# EAGLE design idp (EAGLE 9.6.2)
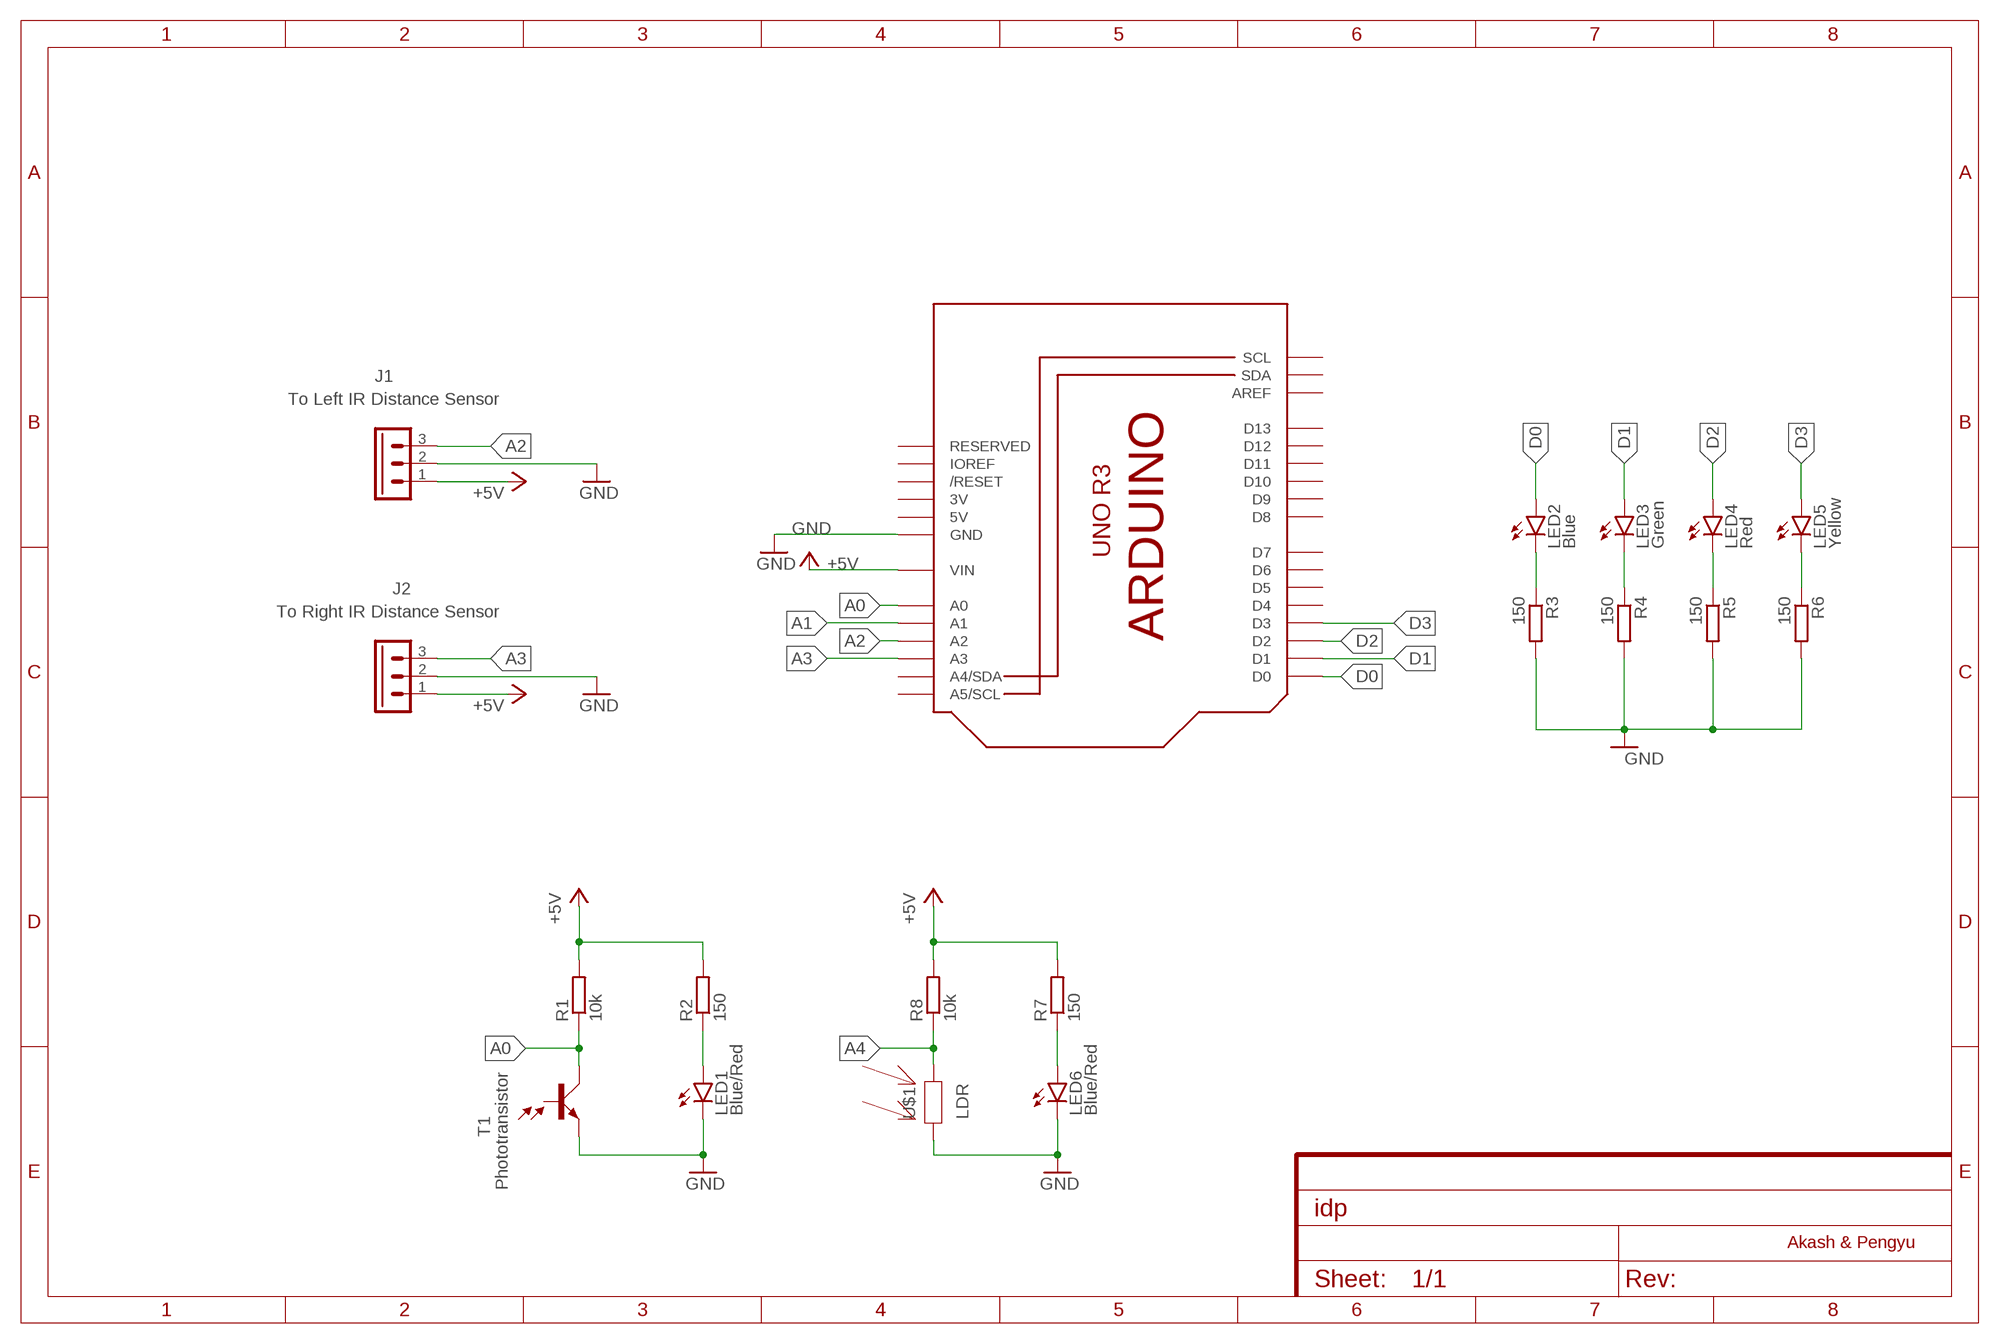
[diagram p0: schematic, sheet 1]

## Parts
J1  To Left IR Distance Sensor  22-05-7038-03  [7395-03]
J2  To Right IR Distance Sensor  22-05-7038-03  [7395-03]
LED1  Blue/Red  LED_23MM  [LED3MM]
LED2  Blue  LED_23MM  [LED3MM]
LED3  Green  LED_23MM  [LED3MM]
LED4  Red  LED_23MM  [LED3MM]
LED5  Yellow  LED_23MM  [LED3MM]
LED6  Blue/Red  LED_23MM  [LED3MM]
M1  IDP_PROTOBOARD  [IDP_PROTO]
R1  10k  R-EU_0204/7  [0204/7]
R2  150  R-EU_0204/7  [0204/7]
R3  150  R-EU_0204/2V  [0204V]
R4  150  R-EU_0204/2V  [0204V]
R5  150  R-EU_0204/2V  [0204V]
R6  150  R-EU_0204/2V  [0204V]
R7  150  R-EU_0204/7  [0204/7]
R8  10k  R-EU_0204/7  [0204/7]
T1  Phototransistor  SFH303  [SFH303]
U$1  LDR  [LDR]

## Nets
+5V: J1.1 J2.1 M1.VIN R1.2 R2.2 R7.2 R8.2
A0: M1.A0 R1.1 T1.2(C)
A1: M1.A1
A2: J1.3 M1.A2
A3: J2.3 M1.A3
A4: R8.1 U$1.P$2
D0: LED2.A M1.D0
D1: LED3.A M1.D1
D2: LED4.A M1.D2
D3: LED5.A M1.D3
GND: J1.2 J2.2 LED1.K(C) LED6.K(C) M1.GND M1.GND16(GND) M1.GND17(GND) M1.GND18(GND) M1.GND19(GND) M1.GND20(GND) M1.GND21(GND) M1.GND22(GND) M1.GND23(GND) M1.GND24(GND) M1.GND25(GND) M1.GND@1(GND) M1.GND@2(GND) M1.GND@3(GND) M1.GND@4(GND) M1.GND@5(GND) M1.GND@6(GND) M1.GND@7(GND) M1.GND@8(GND) M1.GND@9(GND) M1.GND@10(GND) M1.GND@11(GND) M1.GND@12(GND) M1.GND@13(GND) M1.GND@14(GND) M1.GND@15(GND) M1.GND@26(GND) M1.GND@27(GND) M1.GND@28(GND) M1.GND@29(GND) M1.GND@30(GND) M1.GND@31(GND) M1.GND@32(GND) M1.GND@33(GND) M1.GND@34(GND) M1.GND@35(GND) M1.GND@36(GND) M1.GND@37(GND) M1.GND@38(GND) M1.GND@39(GND) M1.GND@40(GND) M1.GND@41(GND) M1.GND@42(GND) M1.GND@43(GND) M1.GND@44(GND) M1.GND@45(GND) M1.GND@46(GND) M1.GND@47(GND) M1.GND@48(GND) R3.2 R4.2 R5.2 R6.2 T1.1(E) U$1.P$1
N$1: LED2.K(C) R3.1
N$2: LED6.A R7.1
N$3: LED1.A R2.1
N$4: LED3.K(C) R4.1
N$5: LED4.K(C) R5.1
N$12: LED5.K(C) R6.1
Unconnected: M1.A4(A4/SDA) M1.A5(A5/SCL) M1.AREF M1.D4 M1.D5 M1.D6 M1.D7 M1.D8 M1.D9 M1.D10 M1.D11 M1.D12 M1.D13 M1.IOREF M1.RESERVED M1.RESET(/RESET) M1.SCL M1.SDA T1.3(B)

## Notes on the sheet
- Akash & Pengyu

## Power pins joined to a net without a drawn wire
3V: M1.3V
5V: M1.5V M1.5V@0(5V) M1.5V@1(5V) M1.5V@2(5V) M1.5V@3(5V) M1.5V@4(5V) M1.5V@5(5V) M1.5V@6(5V) M1.5V@7(5V) M1.5V@8(5V) M1.5V@9(5V) M1.5V@10(5V) M1.5V@11(5V) M1.5V@12(5V) M1.5V@13(5V) M1.5V@14(5V) M1.5V@15(5V) M1.5V@16(5V) M1.5V@17(5V) M1.5V@18(5V) M1.5V@19(5V) M1.5V@20(5V) M1.5V@21(5V) M1.5V@22(5V) M1.5V@23(5V) M1.5V@24(5V) M1.5V@25(5V) M1.5V@26(5V) M1.5V@27(5V) M1.5V@28(5V) M1.5V@29(5V) M1.5V@30(5V) M1.5V@31(5V) M1.5V@32(5V) M1.5V@33(5V) M1.5V@34(5V) M1.5V@35(5V) M1.5V@36(5V) M1.5V@37(5V) M1.5V@38(5V) M1.5V@39(5V) M1.5V@40(5V)

## Library data of the parts
J1 J2 = IDP_library:22-?-03: CONNECTOR wire to board 2.54 mm (.1 inch) pitch header 3 pin Right angle and straight; MF: MOLEX; OC_FARNELL: unknown; OC_NEWARK: unknown
LED1-LED6 = IDP_library:LED_2: LED
M1 = IDP_library:IDP_PROTOBOARD
R1-R8 = IDP_library:R-EU_: RESISTOR, European symbol; SPICEPREFIX: R
T1 = opto-trans-siemens:SFH303: Silicium NPN Phototransistor Source: Siemens; OC_FARNELL: unknown; OC_NEWARK: unknown
U$1 = IDP_library:LDR

## Board
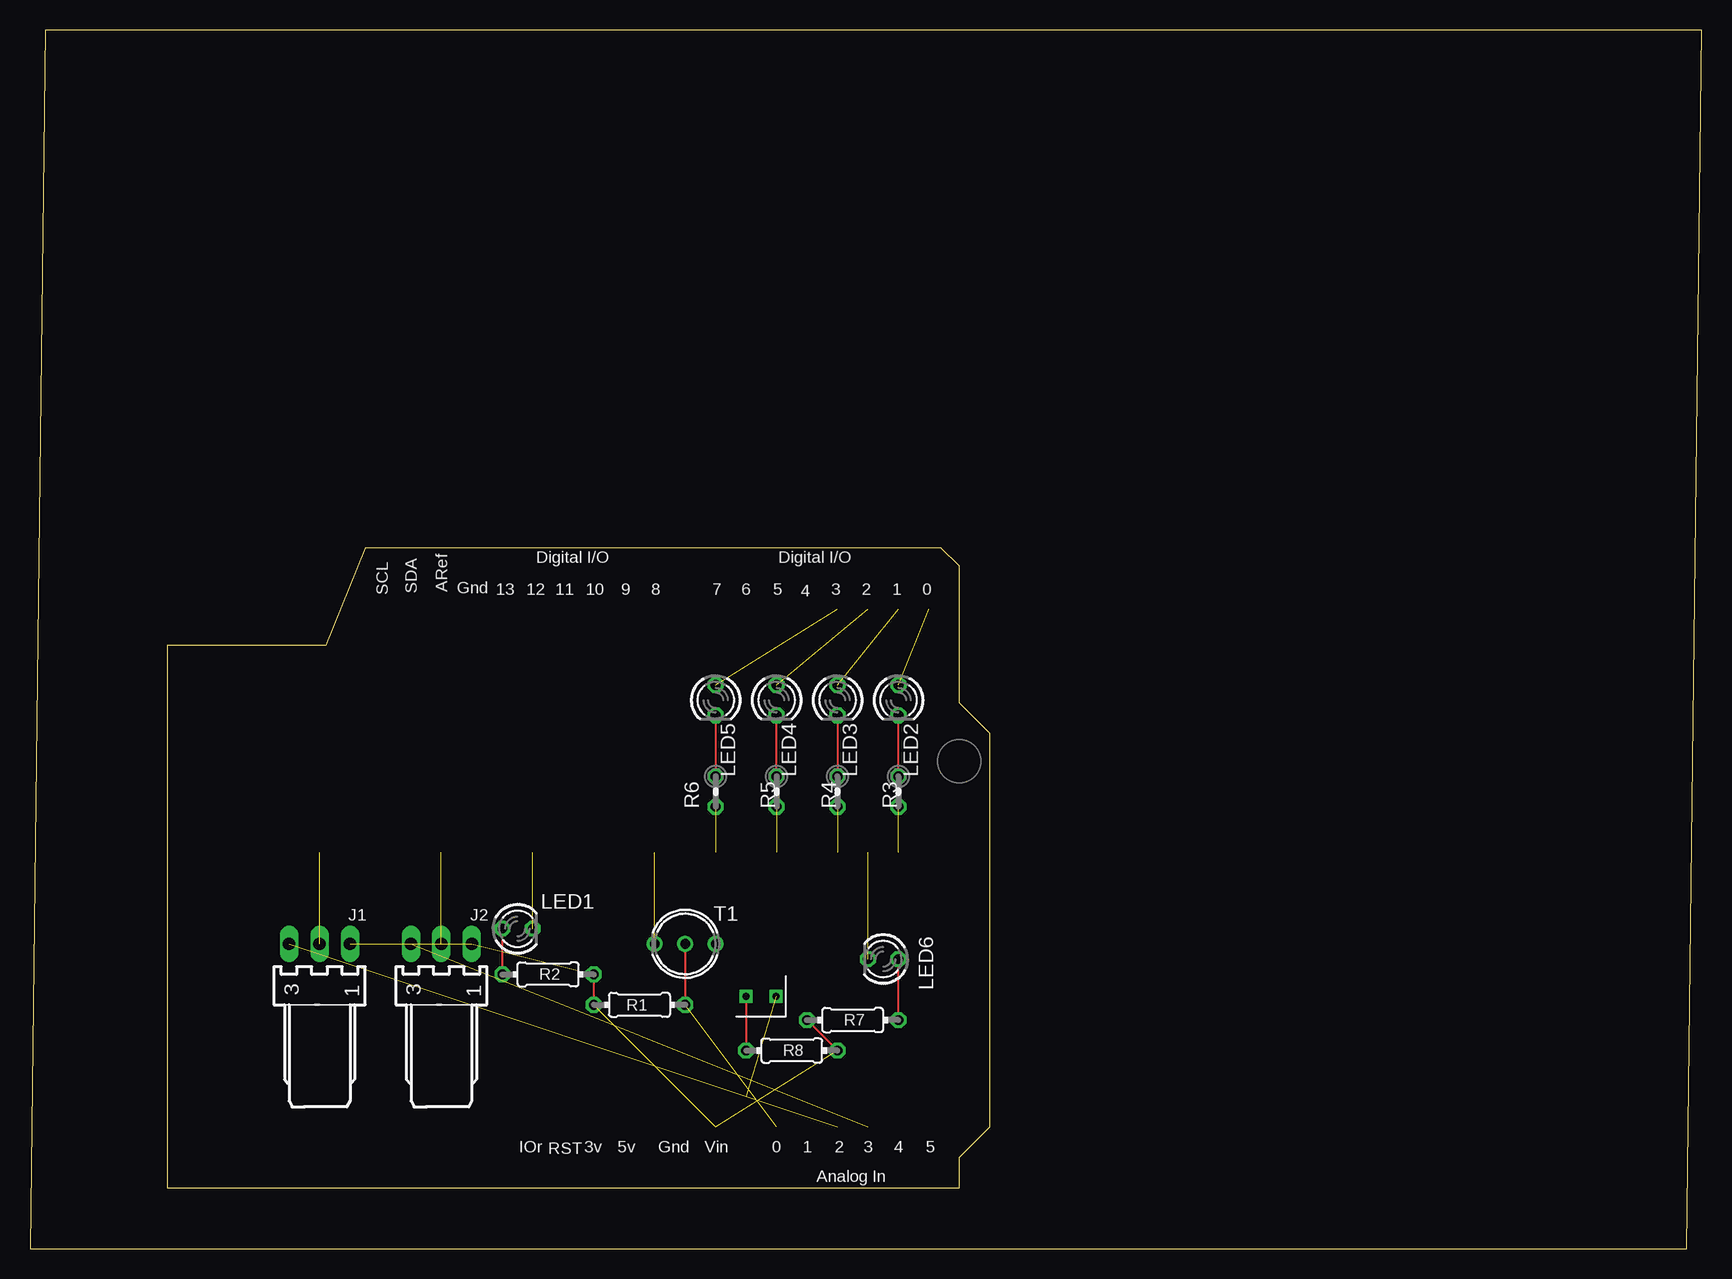
[diagram p1: board, top side]
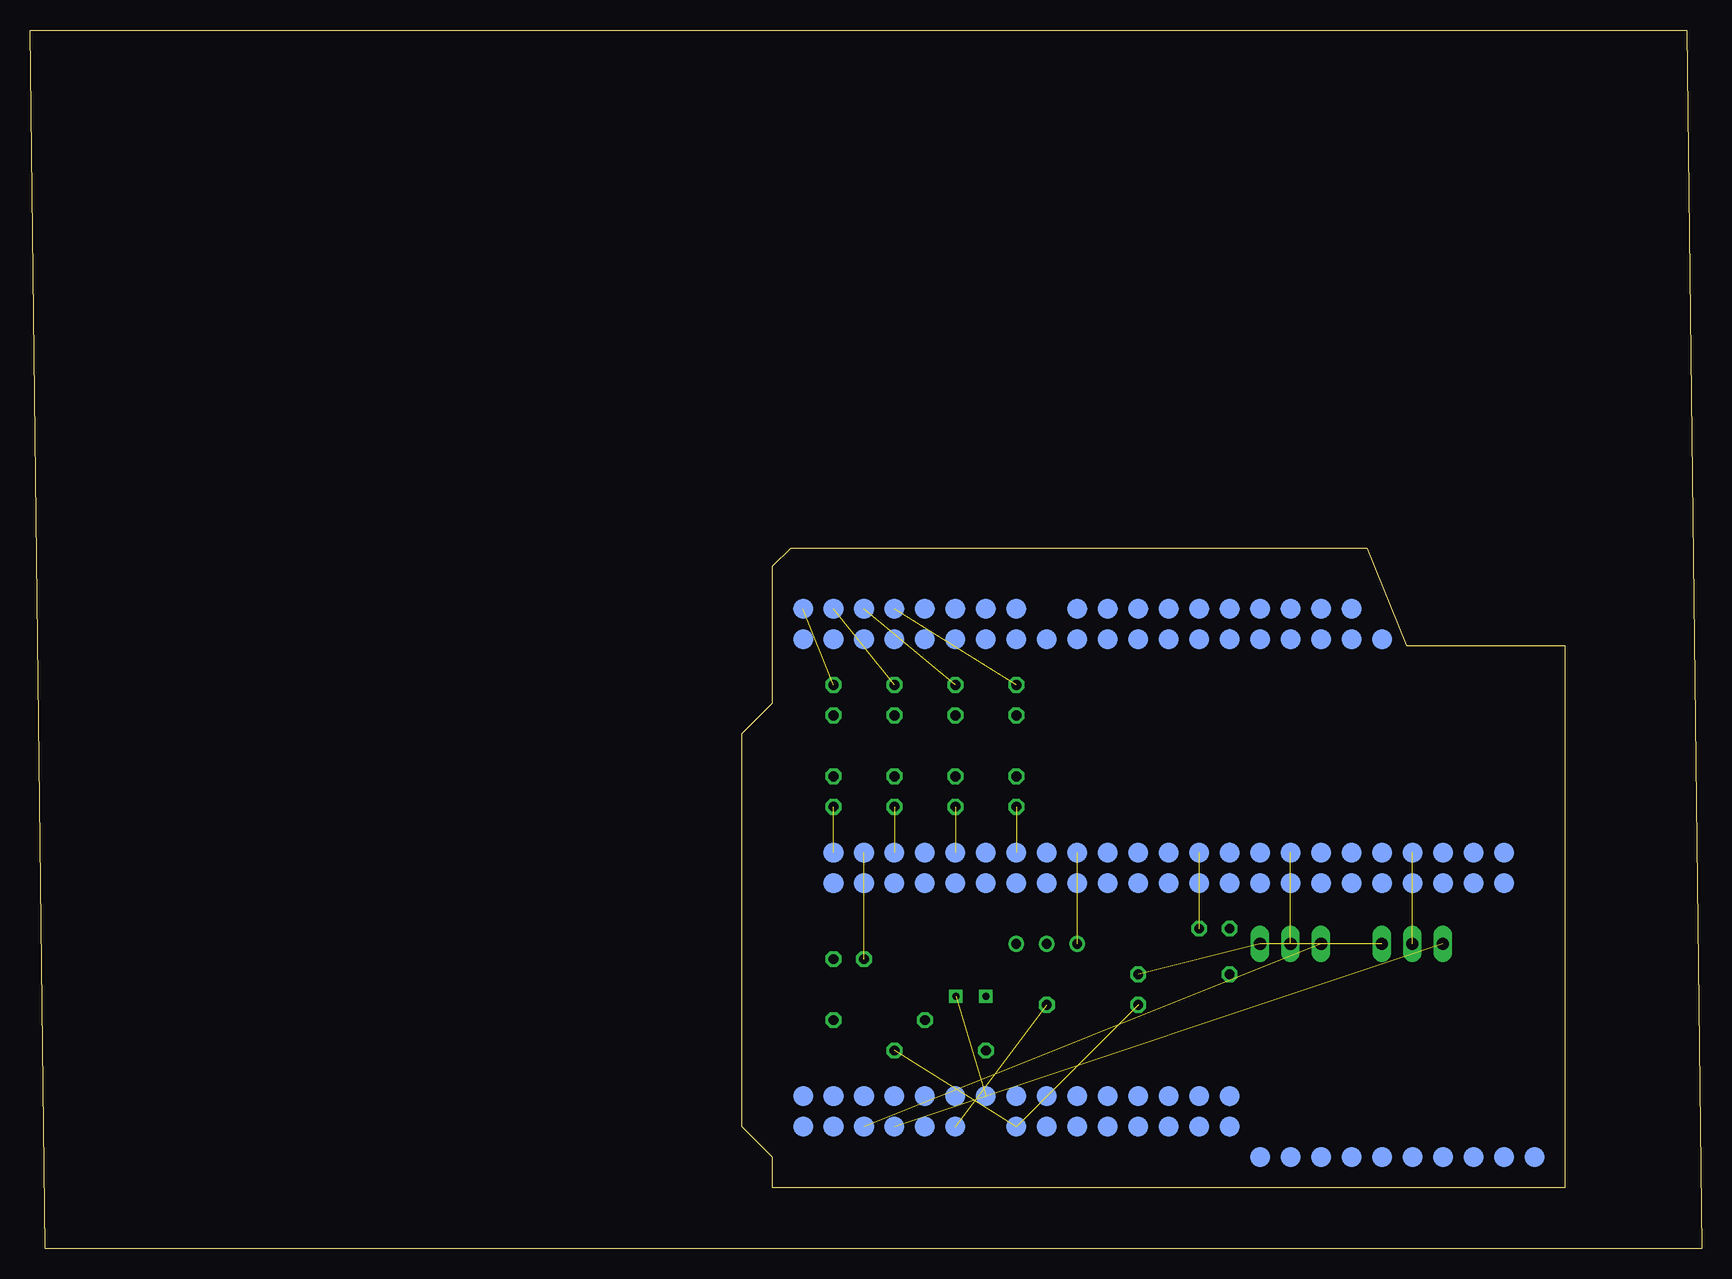
[diagram p2: board, bottom side, seen from below]

Size 139.37 x 101.59 mm. Coordinates in mm from the lower left corner, seen from the top.
Outline: 0,0 138.1,0 139.37,101.59 1.27,101.59 0,0
Copper layers (1*16): Top 0.035mm / dielectric 1.5mm / Bottom 0.035mm
Design rules "default": minimum track width 6mil, minimum drill 0.35mm, track to track 6mil, track to pad 6mil, pad to pad 6mil, via to via 6mil, smd to smd 6mil, copper to edge 40mil, drill to drill 6mil, minimum pad ring 10mil, minimum via ring 8mil, stop-mask expansion 4mil, vias tented up to drill 0mil, thermal gap 10mil

### Footprints (pad centres in the part's own frame; a part is rotated, then mirrored left to right if it is on the bottom)
7395-03 = drill 1.016 long: 1 2.54,0; 2 0,0; 3 -2.54,0
LED3MM = drill 0.813 octagon: A -1.27,0; K 1.27,0
IDP_PROTO = smd 1.676 x 1.676 bottom: 3V 35.56,5.08; 5V 38.1,5.08; 5V@0 15.24,45.72; 5V@1 17.78,45.72; 5V@2 20.32,45.72; 5V@3 22.86,45.72; 5V@4 25.4,45.72; 5V@5 27.94,45.72; 5V@6 30.48,45.72; 5V@7 33.02,45.72; 5V@8 35.56,45.72; 5V@9 38.1,45.72; 5V@10 40.64,45.72; 5V@11 43.18,45.72; 5V@12 45.72,45.72; 5V@13 48.26,45.72; 5V@14 50.8,45.72; 5V@15 53.34,45.72; 5V@16 55.88,45.72; 5V@17 58.42,45.72; 5V@18 5.08,25.4; 5V@19 7.62,25.4; 5V@20 10.16,25.4; 5V@21 12.7,25.4; 5V@22 15.24,25.4; 5V@23 17.78,25.4; 5V@24 20.32,25.4; 5V@25 22.86,25.4; 5V@26 25.4,25.4; 5V@27 27.94,25.4; 5V@28 30.48,25.4; 5V@29 33.02,25.4; 5V@30 35.56,25.4; 5V@31 38.1,25.4; 5V@32 40.64,25.4; 5V@33 43.18,25.4; 5V@34 45.72,25.4; 5V@35 48.26,25.4; 5V@36 50.8,25.4; 5V@37 53.34,25.4; 5V@38 55.88,25.4; 5V@39 58.42,25.4; 5V@40 60.96,25.4; 5V@41 60.96,45.72; 5V@42 63.5,45.72; A0 50.8,5.08; A1 53.34,5.08; A2 55.88,5.08; A3 58.42,5.08; A4 60.96,5.08; A5 63.5,5.08; AREF 22.86,48.26; D0 63.5,48.26; D1 60.96,48.26; D2 58.42,48.26; D3 55.88,48.26; D4 53.34,48.26; D5 50.8,48.26; D6 48.26,48.26; D7 45.72,48.26; D8 40.64,48.26; D9 38.1,48.26; D10 35.56,48.26; D11 33.02,48.26; D12 30.48,48.26; D13 27.94,48.26; GND 25.4,48.26; GND16 2.54,2.54; GND17 5.08,2.54; GND18 7.62,2.54; GND19 10.16,2.54; GND20 12.7,2.54; GND21 15.24,2.54; GND22 17.78,2.54; GND23 20.32,2.54; GND24 22.86,2.54; GND25 25.4,2.54; GND@1 43.18,5.08; GND@2 40.64,5.08; GND@3 27.94,7.62; GND@4 30.48,7.62; GND@5 33.02,7.62; GND@6 35.56,7.62; GND@7 38.1,7.62; GND@8 40.64,7.62; GND@9 43.18,7.62; GND@10 45.72,7.62; GND@11 48.26,7.62; GND@12 50.8,7.62; GND@13 53.34,7.62; GND@14 55.88,7.62; GND@15 58.42,7.62; GND@16 60.96,7.62; GND@17 63.5,7.62; GND@26 5.08,27.94; GND@27 7.62,27.94; GND@28 10.16,27.94; GND@29 12.7,27.94; GND@30 15.24,27.94; GND@31 17.78,27.94; GND@32 20.32,27.94; GND@33 22.86,27.94; GND@34 25.4,27.94; GND@35 27.94,27.94; GND@36 30.48,27.94; GND@37 33.02,27.94; GND@38 35.56,27.94; GND@39 38.1,27.94; GND@40 40.64,27.94; GND@41 43.18,27.94; GND@42 45.72,27.94; GND@43 48.26,27.94; GND@44 50.8,27.94; GND@45 53.34,27.94; GND@46 55.88,27.94; GND@47 58.42,27.94; GND@48 60.96,27.94; IOREF 30.48,5.08; RESERVED 27.94,5.08; RESET 33.02,5.08; SCL 17.78,48.26; SDA 20.32,48.26; VIN 45.72,5.08
0204/7 = drill 0.813 octagon: 1 0,0; 2 7.62,0
0204V = drill 0.813 octagon: 1 -1.27,0; 2 1.27,0
SFH303 = drill 0.8 pad 1.3: 1 0,2.54; 2 0,0; 3 0,-2.54
LDR = drill 0.6 square: P$1 0.8,1.7; P$2 3.3,1.7

### Placement (x,y rotation side)
J1  24.13,25.4 0 top
J2  34.29,25.4 0 top
LED1  40.64,26.67 0 top
LED2  72.39,45.72 270 top
LED3  67.31,45.72 270 top
LED4  62.23,45.72 270 top
LED5  57.15,45.72 270 top
LED6  71.12,24.13 180 top
M1  11.43,5.08 0 top
R1  54.61,20.32 180 top
R2  39.37,22.86 0 top
R3  72.39,38.1 270 top
R4  67.31,38.1 270 top
R5  62.23,38.1 270 top
R6  57.15,38.1 270 top
R7  72.39,19.05 180 top
R8  59.69,16.51 0 top
T1  54.61,25.4 90 top
U$1  62.99,22.73 180 top

### Tracks (layer width: path | path; a pad name or v marks a point on that pad's centre or on a via)
+5V  (4 unrouted)
  Top 0.152: R2.2 R1.2 | R8.2 R7.2
A0  (1 unrouted)
  Top 0.152: T1.2 R1.1
A2  (1 unrouted)
A3  (1 unrouted)
A4
  Top 0.152: U$1.P$2 R8.1
D0  (1 unrouted)
D1  (1 unrouted)
D2  (1 unrouted)
D3  (1 unrouted)
GND  (10 unrouted)
N$1
  Top 0.152: R3.1 LED2.K
N$2
  Top 0.152: R7.1 LED6.A
N$3
  Top 0.152: LED1.A R2.1
N$4
  Top 0.152: LED3.K R4.1
N$5
  Top 0.152: R5.1 LED4.K
N$12
  Top 0.152: LED5.K R6.1